# Altium project IDCI_WifiNode_R00.PrjPcb
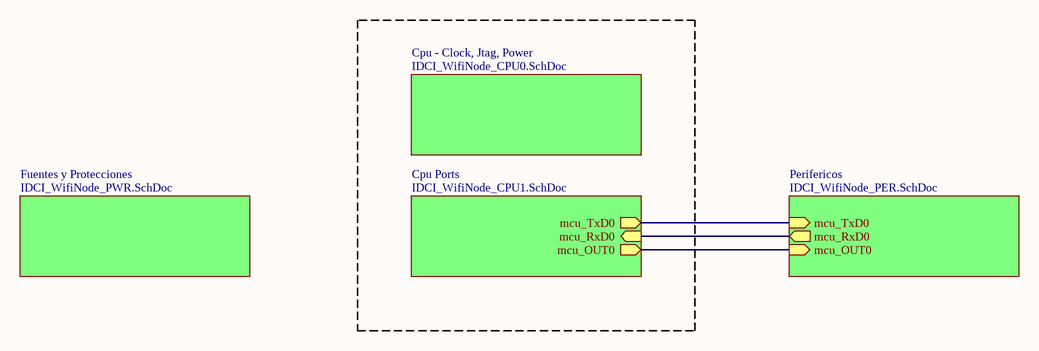
[diagram p0: IDCI_WifiNode_BLK.SchDoc]
3 sheets, 50 parts. Net scope: hierarchical (ports join the sheet entries above them; power ports are global).
Board file: IDCI_WifiNode_2_R00.PcbDoc
Sheets:
  IDCI_WifiNode_BLK.SchDoc
    Cpu - Clock, Jtag, Power = IDCI_WifiNode_CPU0.SchDoc
    Fuentes y Protecciones = IDCI_WifiNode_PWR.SchDoc

## Sheet IDCI_WifiNode_BLK.SchDoc: WifiNoder_BLK
size A4; Author: Luciano Lopez; CompanyName: UTN-FRBA; Revision: 1; SheetNumber: 1; SheetTotal: 5

### Sub-sheets
Cpu - Clock, Jtag, Power = IDCI_WifiNode_CPU0.SchDoc: no entries
Cpu Ports = IDCI_WifiNode_CPU1.SchDoc (file not in this document): mcu_TxD0 (out), mcu_RxD0 (in), mcu_OUT0 (out)
Fuentes y Protecciones = IDCI_WifiNode_PWR.SchDoc: no entries
Perifericos = IDCI_WifiNode_PER.SchDoc (file not in this document): mcu_TxD0 (in), mcu_RxD0 (out), mcu_OUT0 (in)

### Nets
(unnamed): sheet Cpu Ports/mcu_TxD0, sheet Perifericos/mcu_TxD0
(unnamed): sheet Cpu Ports/mcu_RxD0, sheet Perifericos/mcu_RxD0
(unnamed): sheet Cpu Ports/mcu_OUT0, sheet Perifericos/mcu_OUT0

### Notes on the sheet
- Title:
- Size:
- Author:
- A4
- Sheet
- of
- Revision:
- File:
- Date:

## Sheet IDCI_WifiNode_CPU0.SchDoc: WifiNode_CPU0
size A4; Author: Luciano Lopez; CompanyName: UTN - FRBA; Revision: 1; SheetNumber: 3; SheetTotal: 5
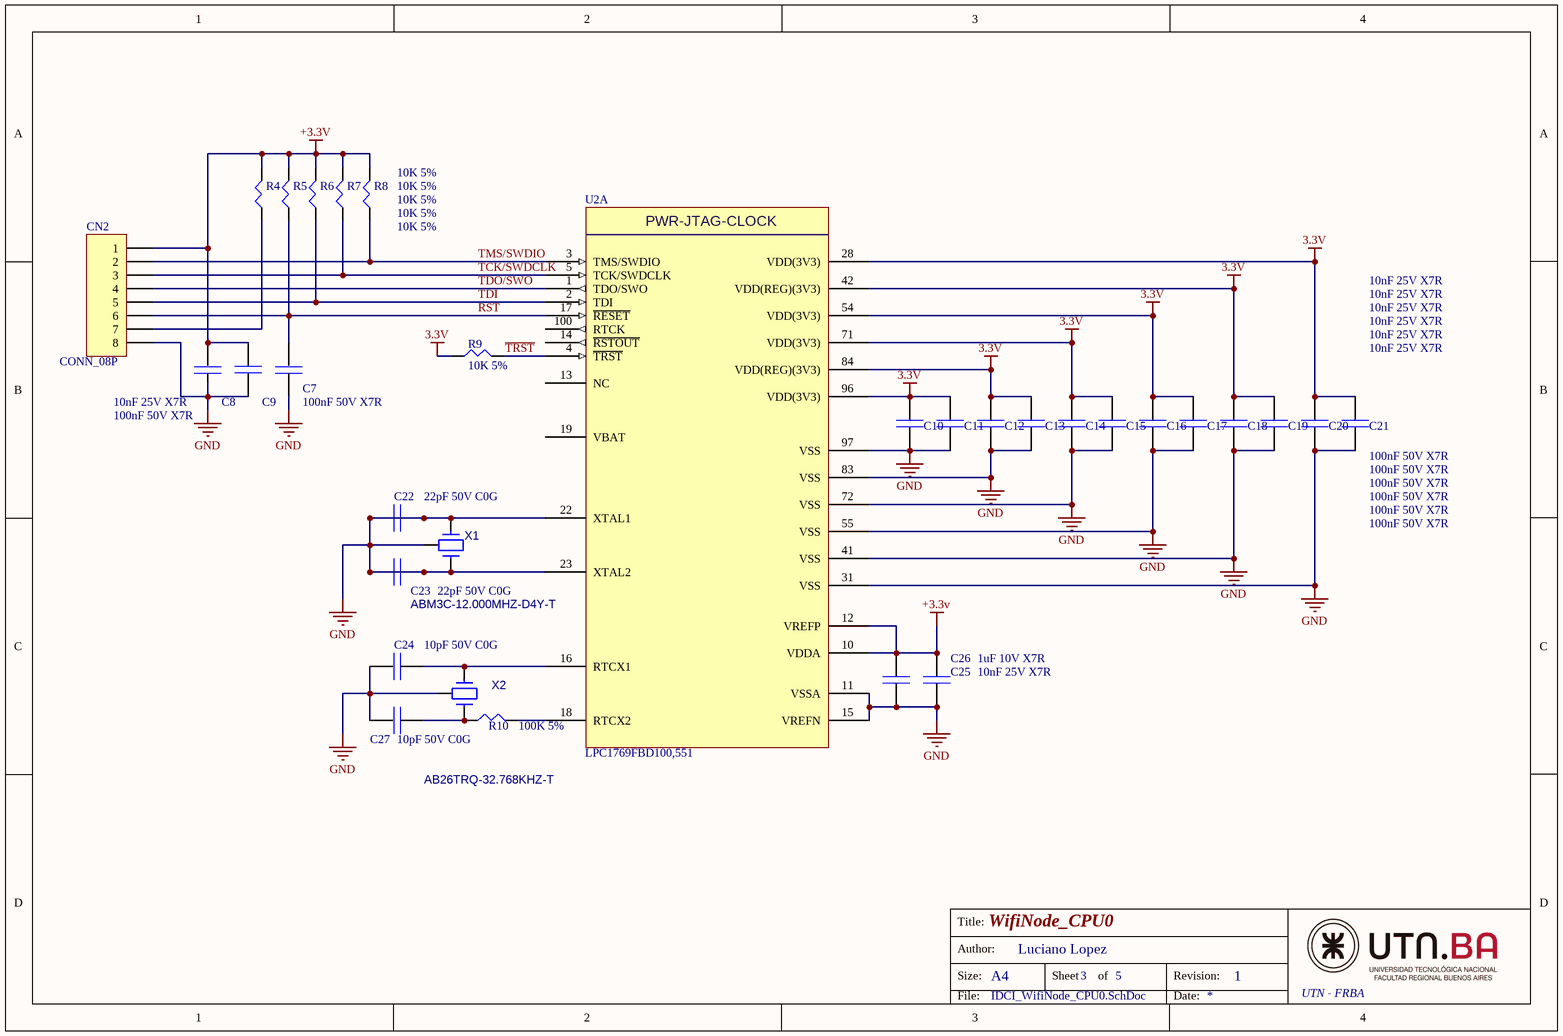
[diagram p1: IDCI_WifiNode_CPU0.SchDoc]

### Parts
C7  100nF 50V X7R  [C_0805]
C8  10nF 25V X7R  [C_0805]
C9  100nF 50V X7R  [C_0805]
C10  100nF 50V X7R  [C_0805]
C11  10nF 25V X7R  [C_0805]
C12  100nF 50V X7R  [C_0805]
C13  10nF 25V X7R  [C_0805]
C14  100nF 50V X7R  [C_0805]
C15  10nF 25V X7R  [C_0805]
C16  100nF 50V X7R  [C_0805]
C17  10nF 25V X7R  [C_0805]
C18  100nF 50V X7R  [C_0805]
C19  10nF 25V X7R  [C_0805]
C20  100nF 50V X7R  [C_0805]
C21  10nF 25V X7R  [C_0805]
C22  22pF 50V C0G  [C_0805]
C23  22pF 50V C0G  [C_0805]
C24  10pF 50V C0G  [C_0805]
C25  10nF 25V X7R  [C_0805]
C26  1uF 10V X7R  [C_0805]
C27  10pF 50V C0G  [C_0805]
CN2  CONN_08P  [HEADER_M_1x8_0.1"]
R4  10K 5%  [R_0805]
R5  10K 5%  [R_0805]
R6  10K 5%  [R_0805]
R7  10K 5%  [R_0805]
R8  10K 5%  [R_0805]
R9  10K 5%  [R_0805]
R10  100K 5%  [R_0805]
U2  LPC1769FBD100,551  [LQFP_100]  (part A of 4)
X1  ABM3C-12.000MHZ-D4Y-T
X2  AB26TRQ-32.768KHZ-T  [CRYSTA_32.768KHZ]

### Nets
3.3V: C10.2 C11.2 C12.2 C13.2 C14.2 C15.2 C16.2 C17.2 C18.2 C19.2 C20.2 C21.2 R9.1 U2.28(VDD(3V3)) U2.42(VDD(REG)(3V3)) U2.54(VDD(3V3)) U2.71(VDD(3V3)) U2.84(VDD(REG)(3V3)) U2.96(VDD(3V3))
+3.3V: C8.1 C9.2 C25.2 C26.2 CN2.1 R4.2 R5.2 R6.2 R7.2 R8.2 U2.10(VDDA) U2.12(VREFP)
GND: C7.2 C8.2 C9.1 C10.1 C11.1 C12.1 C13.1 C14.1 C15.1 C16.1 C17.1 C18.1 C19.1 C20.1 C21.1 C22.1 C22.2 C23.1 C23.2 C24.2 C25.1 C26.1 C27.2 CN2.8 U2.11(VSSA) U2.15(VREFN) U2.22(XTAL1) U2.23(XTAL2) U2.31(VSS) U2.41(VSS) U2.55(VSS) U2.72(VSS) U2.83(VSS) U2.97(VSS) X1.1 X1.2 X1.3 X2.2
~{TRST}: R9.2 U2.4(~{TRST})
RST: C7.1 CN2.6 R5.1 U2.17(~{RESET})
TCK/SWDCLK: CN2.3 R7.1 U2.5(TCK/SWDCLK)
TDI: CN2.5 R6.1 U2.2(TDI)
TDO/SWO: CN2.4 U2.1(TDO/SWO)
TMS/SWDIO: CN2.2 R8.1 U2.3(TMS/SWDIO)
NetC24_1: C24.1 U2.16(RTCX1) X2.3
NetC27_1: C27.1 R10.1 X2.1
NetCN2_7: CN2.7 R4.1
NetR10_2: R10.2 U2.18(RTCX2)

Not connected (* = marked no-connect by the designer): U2 13(NC) 14(~{RSTOUT}) 19(VBAT) 100(RTCK)

### Notes on the sheet
- Title:
- Size:
- Author:
- A4
- Sheet
- of
- Revision:
- File:
- Date:
- (in symbol LPC1769FBD100_Multipart, part A) PWR-JTAG-CLOCK

### Library data of the parts
C7-C27 = CAPACITOR: 100nF x 50v
CN2 = CONN_08P: Connector Generic 8 Vias
R4-R10 = Resistor
U2 = LPC1769FBD100_Multipart: Mcu Cortex M3 LQFP100
X1 X2 = CRYSTAL 3P: Crystal 2 Vias + GND

## Sheet IDCI_WifiNode_PWR.SchDoc: WifiNoder_PWR
size A4; Author: Luciano Lopez; CompanyName: UTN-FRBA; Revision: 1; SheetNumber: 2; SheetTotal: 5
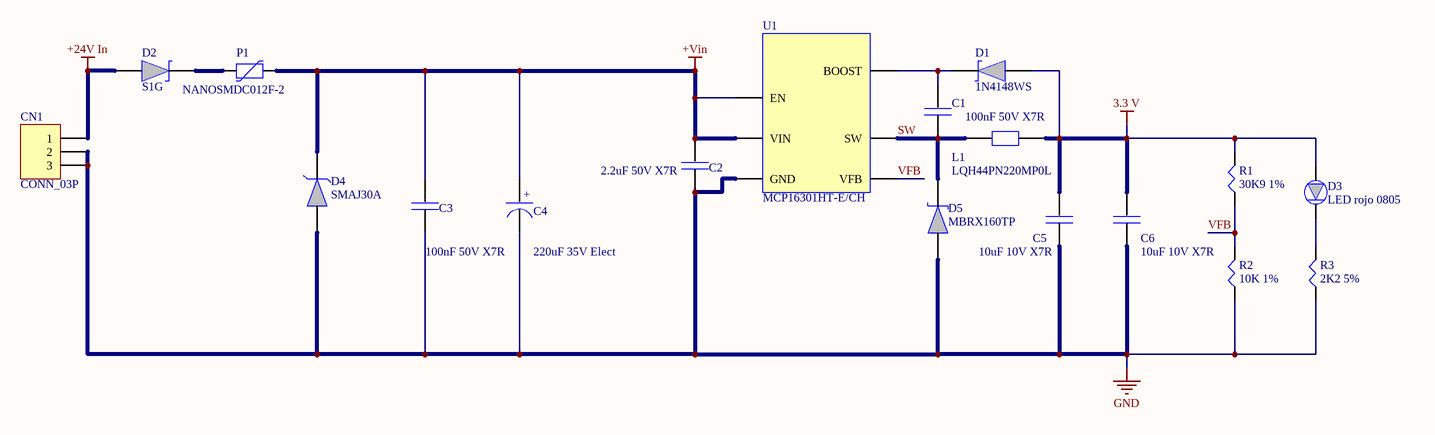
[diagram p2: IDCI_WifiNode_PWR.SchDoc]

### Parts
C1  100nF 50V X7R  [C_0805]
C2  2.2uF 50V X7R  [C_220ufx35V]
C3  100nF 50V X7R  [C_0805]
C4  220uF 35V Elect  [C_220ufx35V]
C5  10uF 10V X7R  [C_0805]
C6  10uF 10V X7R  [C_0805]
CN1  CONN_03P  [JACK_2.5mm_F]
D1  1N4148WS  [Diode_SOD-323]
D2  S1G  [DIODE_SMA]
D3  LED rojo 0805  [LED_0805]
D4  SMAJ30A  [DIODE_SMA]
D5  MBRX160TP  [Diode_SOD-123]
L1  LQH44PN220MP0L  [Inductor_4040]
P1  NANOSMDC012F-2  [Poly_1206]
R1  30K9 1%  [R_0805]
R2  10K 1%  [R_0805]
R3  2K2 5%  [R_0805]
U1  MCP16301HT-E/CH  [IC_SOT23-6]

### Nets
3.3 V: C5.1 C6.1 D1.1 D3.1 L1.2 R1.2
+24V In: CN1.1 D2.1
+Vin: C2.1 C3.1 C4.1 D4.2 P1.2 U1.4(EN) U1.5(VIN)
GND: C2.2 C3.2 C4.2 C5.2 C6.2 CN1.2 CN1.3 D4.1 D5.1 R2.1 R3.1 U1.2(GND)
SW: C1.2 D5.2 L1.1 U1.6(SW)
VFB: R1.1 R2.2 U1.3(VFB)
NetC1_1: C1.1 D1.2 U1.1(BOOST)
NetD2_2: D2.2 P1.1
NetD3_2: D3.2 R3.2

### Notes on the sheet
- Title:
- Size:
- Author:
- A4
- Sheet
- of
- Revision:
- File:
- Date:
- (in symbol POL_CAP) +

### Library data of the parts
C1-C3 C5 C6 = Capacitor: 100nF x 50v
C4 = POL_CAP: Capacitor polarizado
CN1 = CONN_03P: Connector Generic 3 Vias
D1 D2 D5 = TVS_DIODE
D3 = LED_DIODE
D4 = ZENER_DIODE
L1 = Inductor
P1 = Polyswitch
R1-R3 = Resistor
U1 = Integrado: Driver Switching

## Nets that join several sheets
GND: IDCI_WifiNode_CPU0 (38 pins), IDCI_WifiNode_PWR (12 pins)